# Altium project ECG系统 3210105209 谌梓轩.PrjPcb
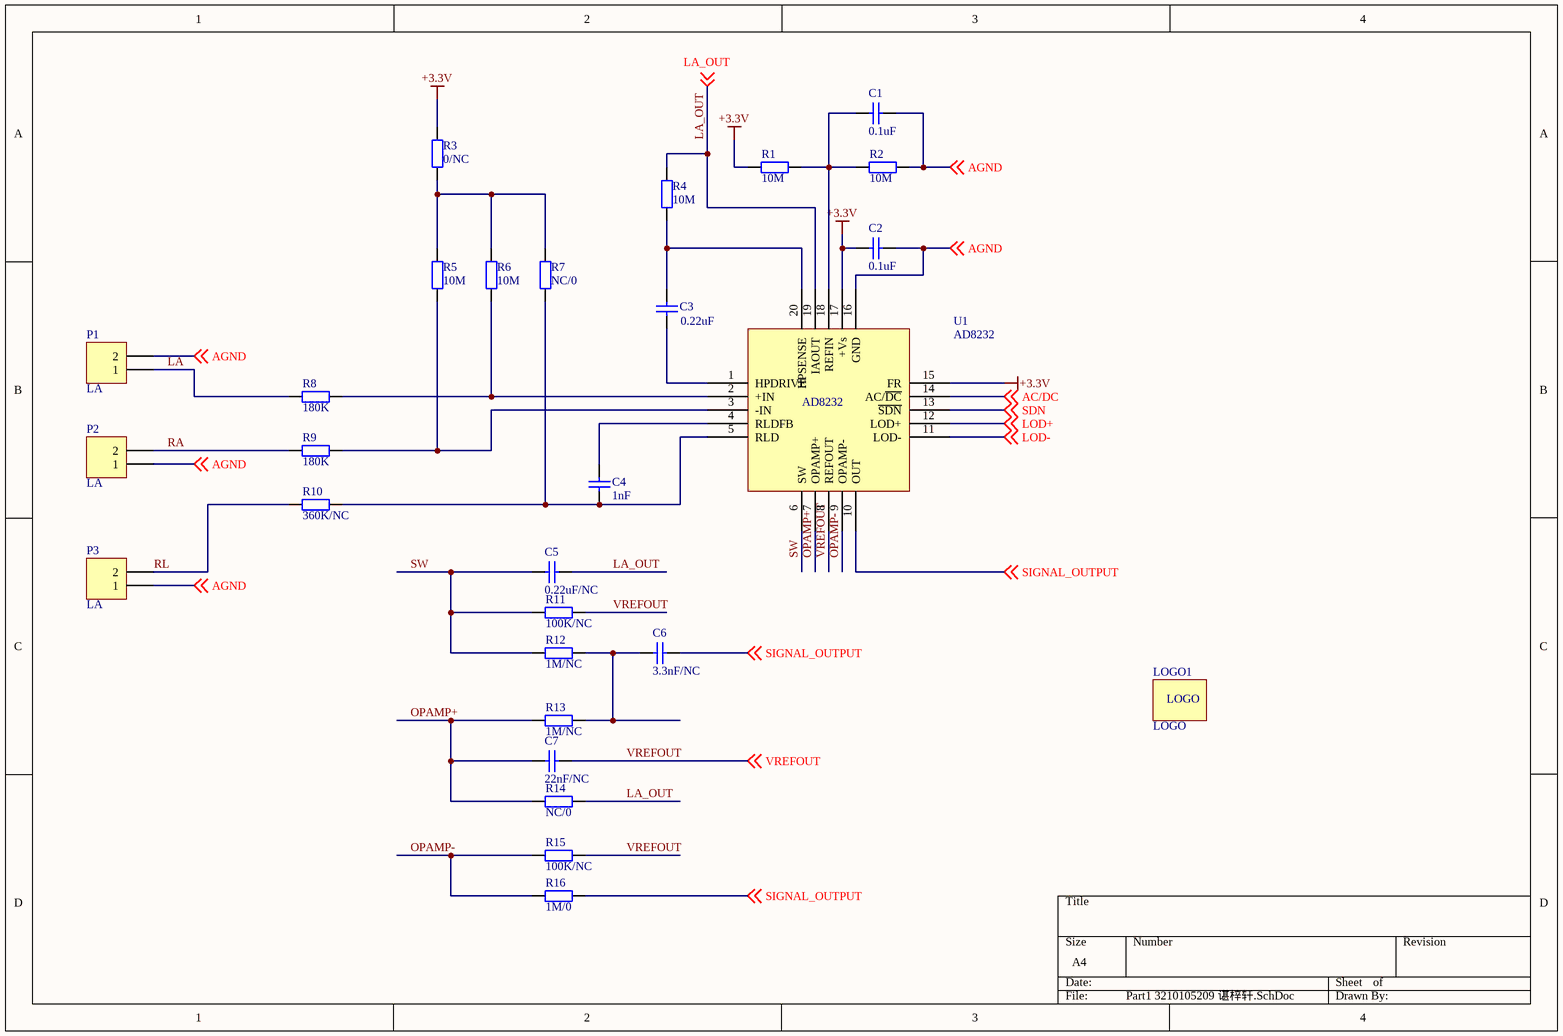
[diagram p0: Part1 3210105209 谌梓轩.SchDoc]
3 sheets, 93 parts. Net scope: global (net labels, ports and power ports of the same name join across sheets).
Board files: PCB 3210105209 谌梓轩.PcbDoc, PCBlogo.PcbDoc
Sheets:
  Part1 3210105209 谌梓轩.SchDoc
  Part2 3210105209 谌梓轩.SchDoc
  Part3 3210105209 谌梓轩.SchDoc

## Sheet Part1 3210105209 谌梓轩.SchDoc
size A4; SheetNumber: 1; SheetTotal: 3

### Parts
C1  0.1uF  [0603C]
C2  0.1uF  [0603C]
C3  0.22uF  [0603C]
C4  1nF  [0603C]
C5  0.22uF/NC  [0603C]
C6  3.3nF/NC  [0603C]
C7  22nF/NC  [0603C]
LOGO1  LOGO  [LOGO]
P1  LA  [SIP2]
P2  LA  [SIP2]
P3  LA  [SIP2]
R1  10M  [0603R]
R2  10M  [0603R]
R3  0/NC  [0603R]
R4  10M  [0603R]
R5  10M  [0603R]
R6  10M  [0603R]
R7  NC/0  [0603R]
R8  180K  [0603R]
R9  180K  [0603R]
R10  360K/NC  [0603R]
R11  100K/NC  [0603R]
R12  1M/NC  [0603R]
R13  1M/NC  [0603R]
R14  NC/0  [0603R]
R15  100K/NC  [0603R]
R16  1M/0  [0603R]
U1  AD8232  [QFN-20]

### Nets
+3.3V: C2.1 R1.1 R3.2 U1.15(FR) U1.17(+Vs)
AGND: C1.2 C2.2 P1.2 P2.1 P3.1 R2.2 U1.16(GND) ; off-sheet AGND
AC/DC: U1.14(AC/~{DC}) ; off-sheet AC/DC  [project net P1.4]
LA: P1.1 R8.1
LA_OUT: C5.2 R4.2 R14.2 U1.19(IAOUT) ; off-sheet LA_OUT
LOD+: U1.12(LOD+) ; off-sheet LOD+  [project net P1.2]
LOD-: U1.11(LOD-) ; off-sheet LOD-  [project net P1.0]
OPAMP+: C7.1 R13.1 R14.1 U1.7(OPAMP+)
OPAMP-: R15.1 R16.1 U1.9(OPAMP-)
RA: P2.2 R9.1
RL: P3.2 R10.1
SDN: U1.13(~{SDN}) ; off-sheet SDN  [project net P1.3]
SIGNAL_OUTPUT: C6.2 R16.2 U1.10(OUT) ; off-sheet SIGNAL_OUTPUT  [project net P1.1]
SW: C5.1 R11.1 R12.1 U1.6(SW)
VREFOUT: C7.2 R11.2 R15.2 U1.8(REFOUT) ; off-sheet VREFOUT
NetC1_1: C1.1 R1.2 R2.1 U1.18(REFIN)
NetC3_1: C3.1 U1.1(HPDRIVE)
NetC3_2: C3.2 R4.1 U1.20(HPSENSE)
NetC4_1: C4.1 R7.1 R10.2 U1.5(RLD)
NetC4_2: C4.2 U1.4(RLDFB)
NetC6_1: C6.1 R12.2 R13.2
NetR3_1: R3.1 R5.2 R6.2 R7.2
NetR5_1: R5.1 R9.2 U1.3(-IN)
NetR6_1: R6.1 R8.2 U1.2(+IN)

### Library data of the parts
C1-C7 = Cap: Capacitor; Value: 75nF; Published: 8-Jun-2000; LatestRevisionDate: 17-Jul-2002; LatestRevisionNote: Re-released for DXP Platform.; PackageReference: RAD-0.3; Publisher: Altium Limited; PackageDescription: Radial Cap, Thru-Hole; 2 Leads; 0.3 in Pin Spacing
P1-P3 = Header 2: Header, 2-Pin; LatestRevisionDate: 17-Jul-2002; LatestRevisionNote: Re-released for DXP Platform.; Publisher: Altium Limited
R1-R16 = Res2: Resistor; Value: 16K; Published: 8-Jun-2000; LatestRevisionDate: 17-Jul-2002; LatestRevisionNote: Re-released for DXP Platform.; PackageReference: AXIAL-0.4; Publisher: Altium Limited; PackageDescription: Axial Device, Thru-Hole; 2 Leads; 0.4 in Pin Spacing

## Sheet Part2 3210105209 谌梓轩.SchDoc
size A4; SheetNumber: 2; SheetTotal: 3
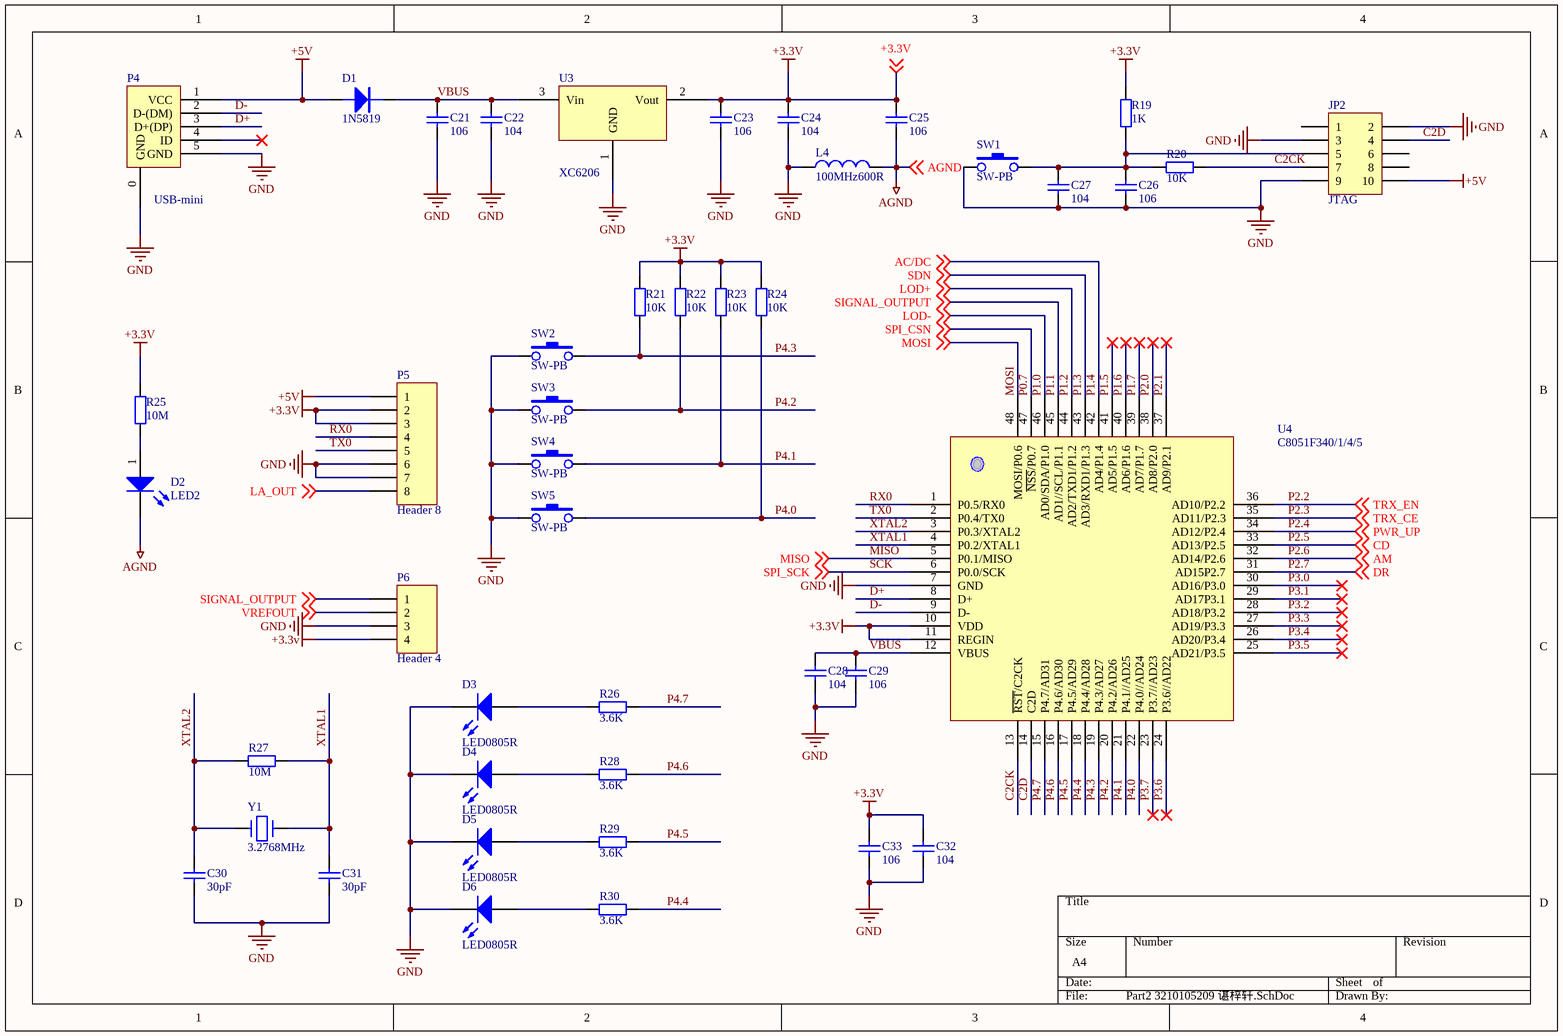
[diagram p1: Part2 3210105209 谌梓轩.SchDoc]

### Parts
C21  106  [0603C]
C22  104  [0603C]
C23  106  [0603C]
C24  104  [0603C]
C25  106  [0603C]
C26  106  [0603C]
C27  104  [0603C]
C28  104  [0603C]
C29  106  [0603C]
C30  30pF  [0603C]
C31  30pF  [0603C]
C32  104  [0603C]
C33  106  [0603C]
D1  1N5819  [SOD-323]
D2  LED2  [LED0805R]
D3  LED0805R  [LED0805R]
D4  LED0805R  [LED0805R]
D5  LED0805R  [LED0805R]
D6  LED0805R  [LED0805R]
JP2  JTAG  [IDC10L]
L4  100MHz600R  [0603-D]
P4  USB-mini  [USB-Micro]
P5  Header 8  [HDR1X8]
P6  Header 4  [SIP4]
R19  1K  [0603R]
R20  10K  [0603R]
R21  10K  [0603R]
R22  10K  [0603R]
R23  10K  [0603R]
R24  10K  [0603R]
R25  10M  [0603R]
R26  3.6K  [0603R]
R27  10M  [0603R]
R28  3.6K  [0603R]
R29  3.6K  [0603R]
R30  3.6K  [0603R]
SW1  SW-PB  [SW-BP-SMD]
SW2  SW-PB  [SW-BP-SMD]
SW3  SW-PB  [SW-BP-SMD]
SW4  SW-PB  [SW-BP-SMD]
SW5  SW-PB  [SW-BP-SMD]
U3  XC6206  [SOT-23-123]
U4  C8051F340/1/4/5  [TQFP48_M]
Y1  3.2768MHz  [CY2]

### Nets
+3.3V: C23.2 C24.2 C25.2 C32.2 C33.2 P5.2 P5.3 P6.4 R19.2 R21.2 R22.2 R23.2 R24.2 R25.2 U3.2(Vout) U4.10(VDD) U4.11(REGIN) ; off-sheet +3.3V
+5V: D1.A JP2.10 P4.1(VCC) P5.1
AGND: C25.1 D2.2(K) L4.2 ; off-sheet AGND
GND: C21.1 C22.1 C23.1 C24.1 C26.2 C27.2 C28.1 C29.1 C30.1 C31.1 C32.1 C33.1 D3.2(K) D4.2(K) D5.2(K) D6.2(K) JP2.2 JP2.3 JP2.9 L4.1 P4.0(GND) P4.5(GND) P5.6 P5.7 P6.3 SW1.1 SW2.1 SW3.1 SW4.1 SW5.1 U3.1(GND) U4.7(GND)
C2CK: JP2.7 R20.2 U4.13(~{RST}/C2CK)
C2D: JP2.4 U4.14(C2D)
D+: P4.3(D+(DP)) U4.8(D+)
D-: P4.2(D-(DM)) U4.9(D-)
LA_OUT: P5.8 ; off-sheet LA_OUT
MISO: U4.5(P0.1/MISO) ; off-sheet MISO
MOSI: U4.48(MOSI/P0.6) ; off-sheet MOSI
P0.7: U4.47(~{NSS}/P0.7) ; off-sheet SPI_CSN  [also labelled SPI_CSN]
P1.0: U4.46(AD0/SDA/P1.0) ; off-sheet LOD-  [also labelled LOD-]
P1.1: P6.1 U4.45(AD1//SCL/P1.1) ; off-sheet SIGNAL_OUTPUT  [also labelled SIGNAL_OUTPUT]
P1.2: U4.44(AD2/TXD1/P1.2) ; off-sheet LOD+  [also labelled LOD+]
P1.3: U4.43(AD3/RXD1/P1.3) ; off-sheet SDN  [also labelled SDN]
P1.4: U4.42(AD4/P1.4) ; off-sheet AC/DC  [also labelled AC/DC]
P1.5: U4.41(AD5/P1.5)
P1.6: U4.40(AD6/P1.6)
P1.7: U4.39(AD7/P1.7)
P2.0: U4.38(AD8/P2.0)
P2.1: U4.37(AD9/P2.1)
P2.2: U4.36(AD10/P2.2) ; off-sheet TRX_EN  [also labelled TRX_EN]
P2.3: U4.35(AD11/P2.3) ; off-sheet TRX_CE  [also labelled TRX_CE]
P2.4: U4.34(AD12/P2.4) ; off-sheet PWR_UP  [also labelled PWR_UP]
P2.5: U4.33(AD13/P2.5) ; off-sheet CD  [also labelled CD]
P2.6: U4.32(AD14/P2.6) ; off-sheet AM  [also labelled AM]
P2.7: U4.31(AD15P2.7) ; off-sheet DR  [also labelled DR]
P3.0: U4.30(AD16/P3.0)
P3.1: U4.29(AD17P3.1)
P3.2: U4.28(AD18/P3.2)
P3.3: U4.27(AD19/P3.3)
P3.4: U4.26(AD20/P3.4)
P3.5: U4.25(AD21/P3.5)
P3.6: U4.24(P3.6//AD22)
P3.7: U4.23(P3.7//AD23)
P4.0: R24.1 SW5.2 U4.22(P4.0//AD24)
P4.1: R23.1 SW4.2 U4.21(P4.1//AD25)
P4.2: R22.1 SW3.2 U4.20(P4.2/AD26)
P4.3: R21.1 SW2.2 U4.19(P4.3/AD27)
P4.4: R30.2 U4.18(P4.4/AD28)
P4.5: R29.2 U4.17(P4.5/AD29)
P4.6: R28.2 U4.16(P4.6/AD30)
P4.7: R26.2 U4.15(P4.7/AD31)
RX0: P5.4 U4.1(P0.5/RX0)
SCK: U4.6(P0.0/SCK) ; off-sheet SPI_SCK  [also labelled SPI_SCK]
TX0: P5.5 U4.2(P0.4/TX0)
VBUS: C21.2 C22.2 C28.2 C29.2 D1.K U3.3(Vin) U4.12(VBUS)
VREFOUT: P6.2 ; off-sheet VREFOUT
XTAL1: C31.2 R27.2 U4.4(P0.2/XTAL1) Y1.2
XTAL2: C30.2 R27.1 U4.3(P0.3/XTAL2) Y1.1
NetC26_1: C26.1 C27.1 JP2.5 R19.1 R20.1 SW1.2
NetD2_1: D2.1(A) R25.1
NetD3_1: D3.1(A) R26.1
NetD4_1: D4.1(A) R28.1
NetD5_1: D5.1(A) R29.1
NetD6_1: D6.1(A) R30.1

Not connected (* = marked no-connect by the designer): JP2 1 6 8; P4 4(ID)*

### Library data of the parts
C21-C33 = Cap: Capacitor; Value: 75nF; Published: 8-Jun-2000; LatestRevisionDate: 17-Jul-2002; LatestRevisionNote: Re-released for DXP Platform.; PackageReference: RAD-0.3; Publisher: Altium Limited; PackageDescription: Radial Cap, Thru-Hole; 2 Leads; 0.3 in Pin Spacing
D1 = DIODE
D2 = LED2: Typical RED, GREEN, YELLOW, AMBER GaAs LED; pin to pad: 1>A 2>K; Published: 8-Jun-2000; LatestRevisionDate: 17-Jul-2002; LatestRevisionNote: Re-released for DXP Platform.; PackageVersion: Feb-2002; PackageReference: 3.2X1.6X1.1; Publisher: Altium Limited
D3-D6 = LED0: Typical INFRARED GaAs LED; Published: 8-Jun-2000; LatestRevisionDate: 08-Jul-2005; LatestRevisionNote: Mech Layer 1 removed.; PackageReference: LED-0; Publisher: Altium Limited; PackageDescription: LED; 2 Leads
JP2 = Header 5X2: Header, 5-Pin, Dual row; LatestRevisionDate: 17-Jul-2002; LatestRevisionNote: Re-released for DXP Platform.; Publisher: Altium Limited
L4 = INDUCTOR
P5 = Header 8: Header, 8-Pin; LatestRevisionDate: 17-Jul-2002; LatestRevisionNote: Re-released for DXP Platform.; Publisher: Altium Limited
P6 = Header 4: Header, 4-Pin; LatestRevisionDate: 17-Jul-2002; LatestRevisionNote: Re-released for DXP Platform.; Publisher: Altium Limited
R19-R30 = Res2: Resistor; Value: 16K; Published: 8-Jun-2000; LatestRevisionDate: 17-Jul-2002; LatestRevisionNote: Re-released for DXP Platform.; PackageReference: AXIAL-0.4; Publisher: Altium Limited; PackageDescription: Axial Device, Thru-Hole; 2 Leads; 0.4 in Pin Spacing
Y1 = CRYSTAL

## Sheet Part3 3210105209 谌梓轩.SchDoc
size A4; SheetNumber: 3; SheetTotal: 3
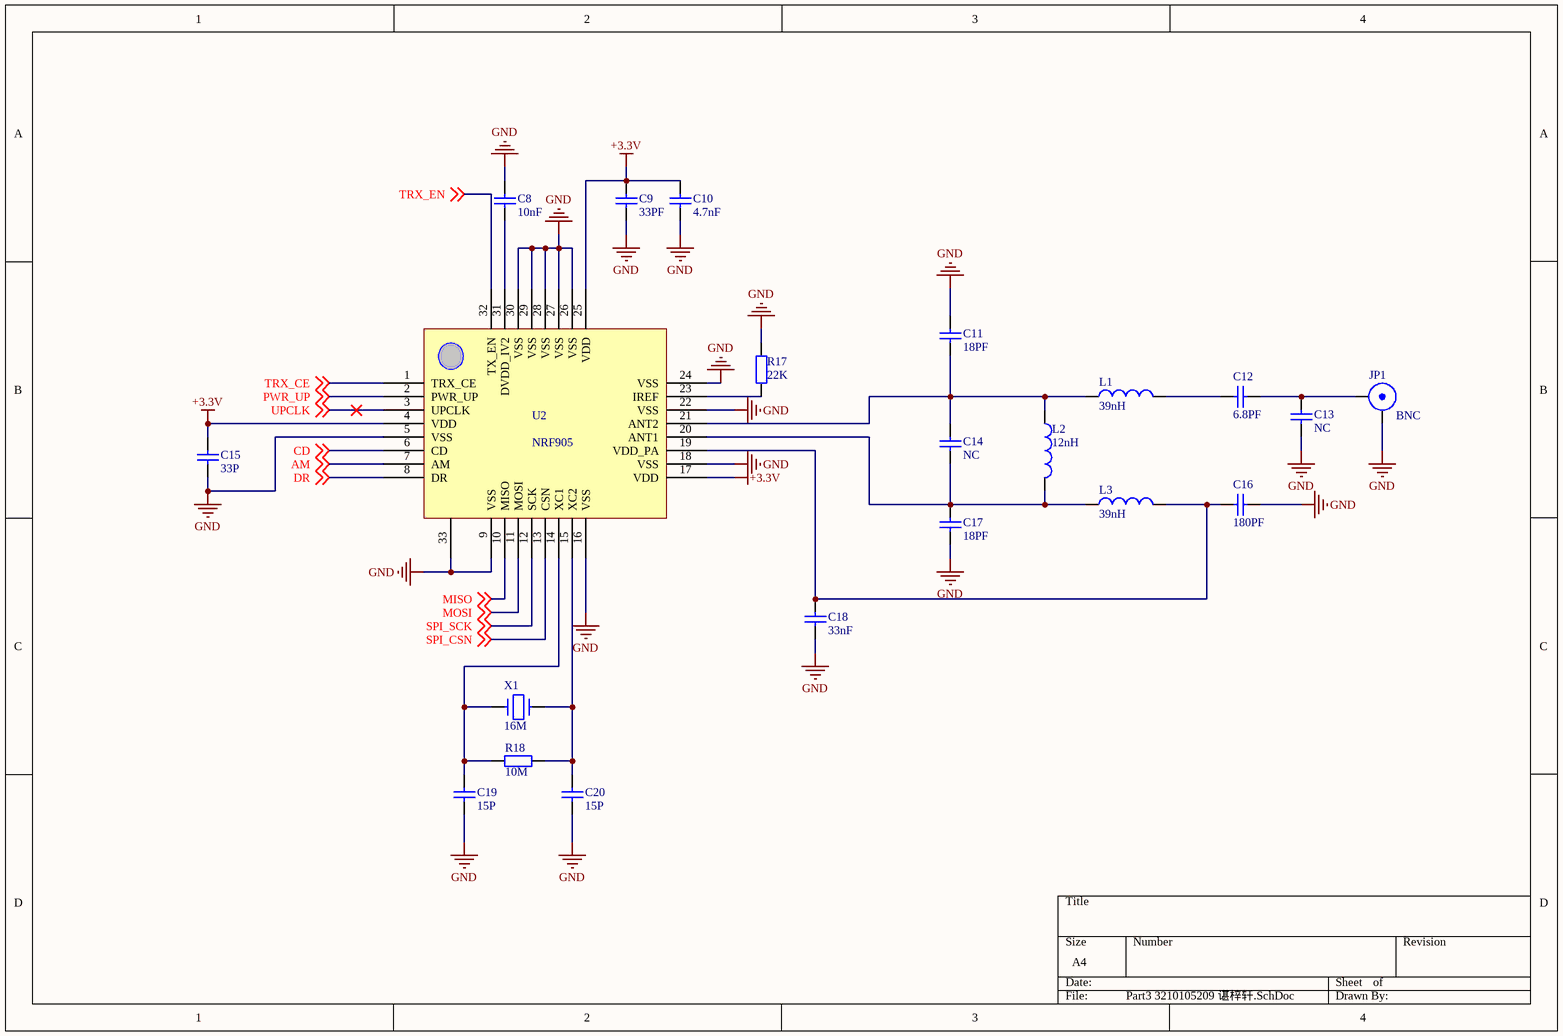
[diagram p2: Part3 3210105209 谌梓轩.SchDoc]

### Parts
C8  10nF  [0603C]
C9  33PF  [0603C]
C10  4.7nF  [0603C]
C11  18PF  [0603C]
C12  6.8PF  [0603C]
C13  NC  [0603C]
C14  NC  [0603C]
C15  33P  [0603C]
C16  180PF  [0603C]
C17  18PF  [0603C]
C18  33nF  [0603C]
C19  15P  [0603C]
C20  15P  [0603C]
JP1  BNC  [SMA]
L1  39nH  [0603-D]
L2  12nH  [0603-D]
L3  39nH  [0603-D]
R17  22K  [0603R]
R18  10M  [0603R]
U2  NRF905  [QFN32_M]
X1  16M  [CY2]

### Nets
+3.3V: C9.2 C10.2 C15.2 U2.4(VDD) U2.17(VDD) U2.25(VDD)
GND: C8.2 C9.1 C10.1 C11.2 C13.1 C15.1 C16.2 C17.1 C18.1 C19.1 C20.1 JP1.1 R17.2 U2.5(VSS) U2.9(VSS) U2.16(VSS) U2.18(VSS) U2.22(VSS) U2.24(VSS) U2.26(VSS) U2.27(VSS) U2.28(VSS) U2.29(VSS) U2.30(VSS) U2.33
AM: U2.7(AM) ; off-sheet AM  [project net P2.6]
CD: U2.6(CD) ; off-sheet CD  [project net P2.5]
DR: U2.8(DR) ; off-sheet DR  [project net P2.7]
MISO: U2.10(MISO) ; off-sheet MISO
MOSI: U2.11(MOSI) ; off-sheet MOSI
PWR_UP: U2.2(PWR_UP) ; off-sheet PWR_UP  [project net P2.4]
SPI_CSN: U2.13(CSN) ; off-sheet SPI_CSN  [project net P0.7]
SPI_SCK: U2.12(SCK) ; off-sheet SPI_SCK  [project net SCK]
TRX_CE: U2.1(TRX_CE) ; off-sheet TRX_CE  [project net P2.3]
TRX_EN: U2.32(TX_EN) ; off-sheet TRX_EN  [project net P2.2]
UPCLK: U2.3(UPCLK) ; off-sheet UPCLK
NetC8_1: C8.1 U2.31(DVDD_IV2)
NetC11_1: C11.1 C14.2 L1.1 L2.1 U2.21(ANT2)
NetC12_1: C12.1 L1.2
NetC12_2: C12.2 C13.2 JP1.2
NetC14_1: C14.1 C17.2 L2.2 L3.1 U2.20(ANT1)
NetC16_1: C16.1 C18.2 L3.2 U2.19(VDD_PA)
NetC19_2: C19.2 R18.1 U2.14(XC1) X1.1
NetC20_2: C20.2 R18.2 U2.15(XC2) X1.2
NetR17_1: R17.1 U2.23(IREF)

### Library data of the parts
C8-C20 = Cap: Capacitor; Value: 75nF; Published: 8-Jun-2000; LatestRevisionDate: 17-Jul-2002; LatestRevisionNote: Re-released for DXP Platform.; PackageReference: RAD-0.3; Publisher: Altium Limited; PackageDescription: Radial Cap, Thru-Hole; 2 Leads; 0.3 in Pin Spacing
L1-L3 = INDUCTOR
R17 R18 = Res2: Resistor; Value: 16K; Published: 8-Jun-2000; LatestRevisionDate: 17-Jul-2002; LatestRevisionNote: Re-released for DXP Platform.; PackageReference: AXIAL-0.4; Publisher: Altium Limited; PackageDescription: Axial Device, Thru-Hole; 2 Leads; 0.4 in Pin Spacing
U2 = Component_1_1
X1 = CRYSTAL

## Nets that join several sheets
+3.3V: Part1 3210105209 谌梓轩 (5 pins), Part2 3210105209 谌梓轩 (17 pins), Part3 3210105209 谌梓轩 (6 pins)
AGND: Part1 3210105209 谌梓轩 (7 pins), Part2 3210105209 谌梓轩 (C25.1 D2.2 L4.2)
GND: Part2 3210105209 谌梓轩 (32 pins), Part3 3210105209 谌梓轩 (25 pins)
LA_OUT: Part1 3210105209 谌梓轩 (C5.2 R4.2 R14.2 U1.19), Part2 3210105209 谌梓轩 (P5.8)
MISO: Part2 3210105209 谌梓轩 (U4.5), Part3 3210105209 谌梓轩 (U2.10)
MOSI: Part2 3210105209 谌梓轩 (U4.48), Part3 3210105209 谌梓轩 (U2.11)
P0.7: Part2 3210105209 谌梓轩 (U4.47), Part3 3210105209 谌梓轩 (U2.13)
P1.0: Part1 3210105209 谌梓轩 (U1.11), Part2 3210105209 谌梓轩 (U4.46)
P1.1: Part1 3210105209 谌梓轩 (C6.2 R16.2 U1.10), Part2 3210105209 谌梓轩 (P6.1 U4.45)
P1.2: Part1 3210105209 谌梓轩 (U1.12), Part2 3210105209 谌梓轩 (U4.44)
P1.3: Part1 3210105209 谌梓轩 (U1.13), Part2 3210105209 谌梓轩 (U4.43)
P1.4: Part1 3210105209 谌梓轩 (U1.14), Part2 3210105209 谌梓轩 (U4.42)
P2.2: Part2 3210105209 谌梓轩 (U4.36), Part3 3210105209 谌梓轩 (U2.32)
P2.3: Part2 3210105209 谌梓轩 (U4.35), Part3 3210105209 谌梓轩 (U2.1)
P2.4: Part2 3210105209 谌梓轩 (U4.34), Part3 3210105209 谌梓轩 (U2.2)
P2.5: Part2 3210105209 谌梓轩 (U4.33), Part3 3210105209 谌梓轩 (U2.6)
P2.6: Part2 3210105209 谌梓轩 (U4.32), Part3 3210105209 谌梓轩 (U2.7)
P2.7: Part2 3210105209 谌梓轩 (U4.31), Part3 3210105209 谌梓轩 (U2.8)
SCK: Part2 3210105209 谌梓轩 (U4.6), Part3 3210105209 谌梓轩 (U2.12)
VREFOUT: Part1 3210105209 谌梓轩 (C7.2 R11.2 R15.2 U1.8), Part2 3210105209 谌梓轩 (P6.2)